# Altium schematic sheet reels.SchDoc
size Tabloid
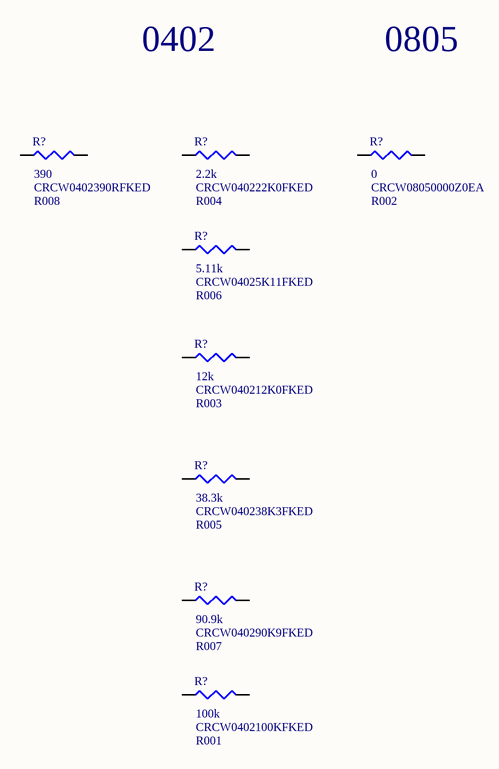
[diagram p0: reels.SchDoc]

## Parts
(Parts that share a designator on the sheet are numbered #1, #2 ... from top to bottom, then left to right.)
R?#1  CRCW0402390RFKED  value 390  Reel: R008  [0402]
R?#2  CRCW040222K0FKED  value 2.2k  Reel: R004  [0402]
R?#3  CRCW08050000Z0EA  value 0  Reel: R002  [0805]
R?#4  CRCW04025K11FKED  value 5.11k  Reel: R006  [0402]
R?#5  CRCW040212K0FKED  value 12k  Reel: R003  [0402]
R?#6  CRCW040238K3FKED  value 38.3k  Reel: R005  [0402]
R?#7  CRCW040290K9FKED  value 90.9k  Reel: R007  [0402]
R?#8  CRCW0402100KFKED  value 100k  Reel: R001  [0402]

## Nets

Not connected (* = marked no-connect by the designer): R?#1 1 2; R?#2 1 2; R?#3 1 2; R?#4 1 2; R?#5 1 2; R?#6 1 2; R?#7 1 2; R?#8 1 2

## Notes on the sheet
- 0402
- 0805

## Library data of the parts
R?#1 R?#2 R?#4-R?#8 = CRCW0402xxxxFKED: 0.125W, -55-155C, 1005, 50V, ±1%
R?#3 = R-MISC: 0.125W, -55-155C, 1005, 50V, ±1%